# Altium project 驱动电路1_0.PrjPcb
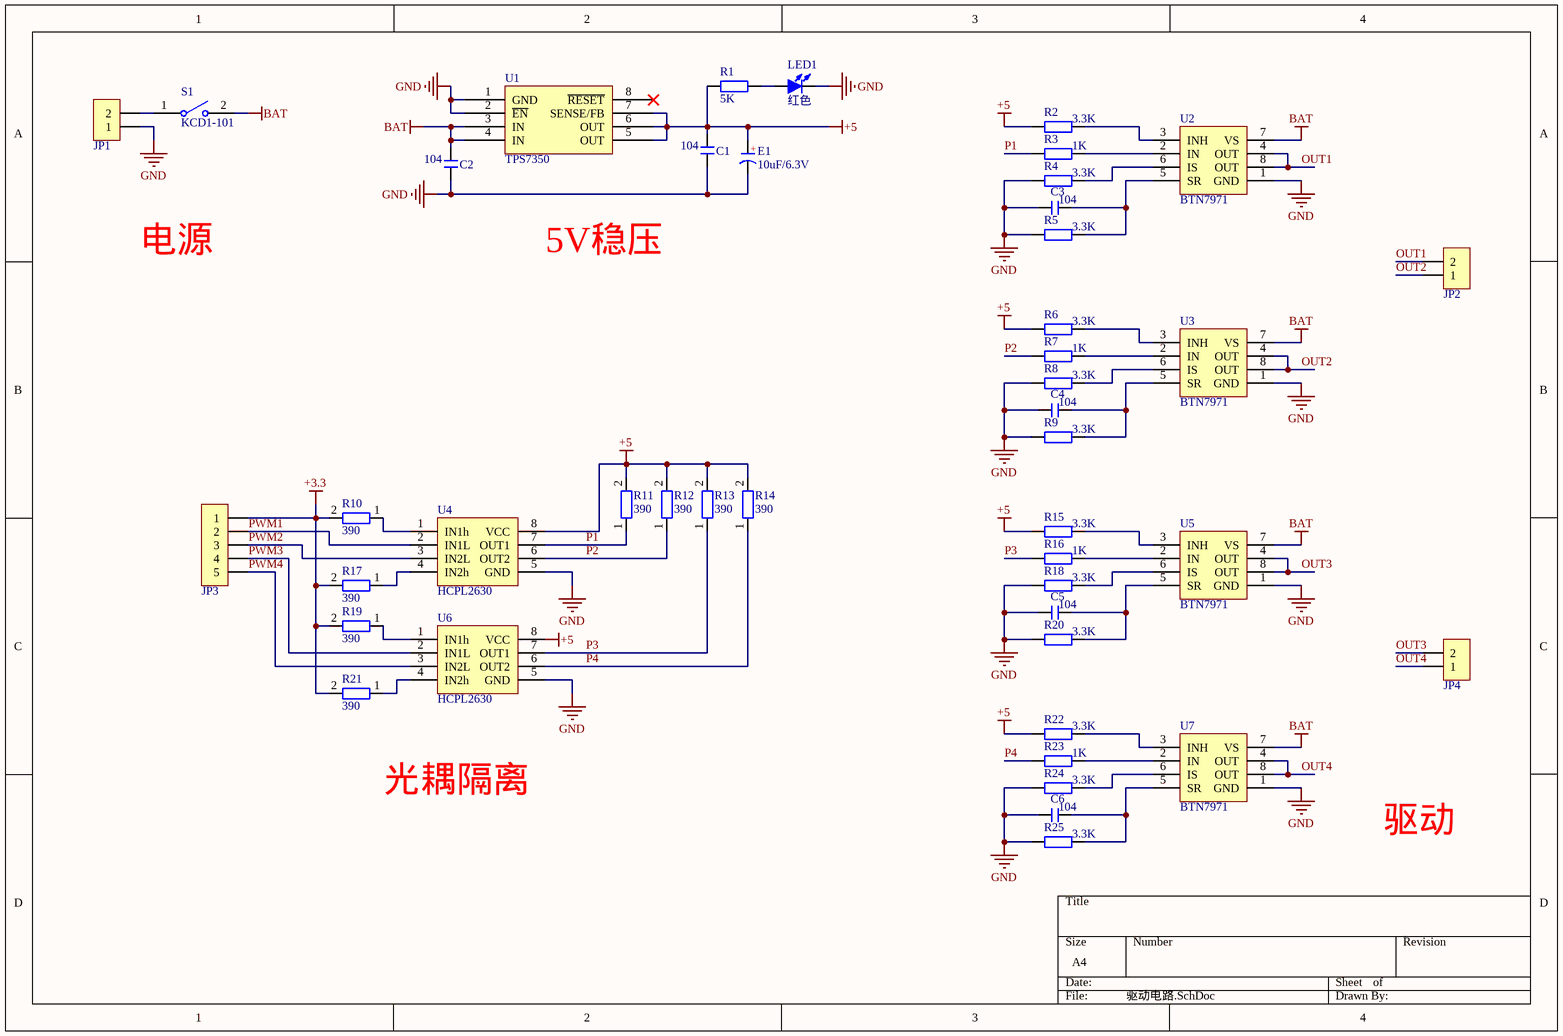
[diagram p0: 驱动电路.SchDoc]
1 sheet, 45 parts. Net scope: global (net labels, ports and power ports of the same name join across sheets).
Board file: 驱动电路1-0.PcbDoc

## Sheet 驱动电路.SchDoc
size A4

### Parts
C1  104  [C 0805_M]
C2  104  [C 0805_M]
C3  104  [C 0805_M]
C4  104  [C 0805_M]
C5  104  [C 0805_M]
C6  104  [C 0805_M]
E1  10uF/6.3V  [CD A(3216)]
JP1  HDR-1X2  [KF128-5.08-2P]  (value not drawn)
JP2  HDR-1X2  [KF128-5.08-2P]  (value not drawn)
JP3  HDR-1X5  [XH2.54-LI-5P]  (value not drawn)
JP4  HDR-1X2  [KF128-5.08-2P]  (value not drawn)
LED1  红色  [LED 0805R]
R1  5K  [R 0805-HP_M]
R2  3.3K  [R 0805-HP_M]
R3  1K  [R 0805-HP_M]
R4  3.3K  [R 0805-HP_M]
R5  3.3K  [R 0805-HP_M]
R6  3.3K  [R 0805-HP_M]
R7  1K  [R 0805-HP_M]
R8  3.3K  [R 0805-HP_M]
R9  3.3K  [R 0805-HP_M]
R10  390  [R 2512_M]
R11  390  [R 2512_M]
R12  390  [R 2512_M]
R13  390  [R 2512_M]
R14  390  [R 2512_M]
R15  3.3K  [R 0805-HP_M]
R16  1K  [R 0805-HP_M]
R17  390  [R 2512_M]
R18  3.3K  [R 0805-HP_M]
R19  390  [R 2512_M]
R20  3.3K  [R 0805-HP_M]
R21  390  [R 2512_M]
R22  3.3K  [R 0805-HP_M]
R23  1K  [R 0805-HP_M]
R24  3.3K  [R 0805-HP_M]
R25  3.3K  [R 0805-HP_M]
S1  KCD1-101  [KCD1-101]
U1  TPS7350  [SOP8]
U2  BTN7971  [DPAK127P1615X127-8N]
U3  BTN7971  [DPAK127P1615X127-8N]
U4  HCPL2630  [SOP8]
U5  BTN7971  [DPAK127P1615X127-8N]
U6  HCPL2630  [SOP8]
U7  BTN7971  [DPAK127P1615X127-8N]

### Nets
+3.3: JP3.1 R10.2 R17.2 R19.2 R21.2
+5: C1.2 E1.1(A) R1.1 R2.1 R6.1 R11.2 R12.2 R13.2 R14.2 R15.1 R22.1 U1.5(OUT) U1.6(OUT) U1.7(SENSE/FB) U4.8(VCC) U6.8(VCC)
BAT: C2.2 S1.2 U1.3(IN) U1.4(IN) U2.7(VS) U3.7(VS) U5.7(VS) U7.7(VS)
GND: C1.1 C2.1 C3.2 C4.2 C5.2 C6.2 E1.2(K) JP1.1 LED1.2(K) R4.1 R5.1 R8.1 R9.1 R18.1 R20.1 R24.1 R25.1 U1.1(GND) U1.2(~{EN}) U2.1(GND) U3.1(GND) U4.5(GND) U5.1(GND) U6.5(GND) U7.1(GND)
OUT1: JP2.2 U2.4(OUT) U2.8(OUT)
OUT2: JP2.1 U3.4(OUT) U3.8(OUT)
OUT3: JP4.2 U5.4(OUT) U5.8(OUT)
OUT4: JP4.1 U7.4(OUT) U7.8(OUT)
P1: R3.1 R11.1 U4.7(OUT1)
P2: R7.1 R12.1 U4.6(OUT2)
P3: R13.1 R16.1 U6.7(OUT1)
P4: R14.1 R23.1 U6.6(OUT2)
PWM1: JP3.2 U4.2(IN1L)
PWM2: JP3.3 U4.3(IN2L)
PWM3: JP3.4 U6.2(IN1L)
PWM4: JP3.5 U6.3(IN2L)
NetC3_1: C3.1 R5.2 U2.5(SR)
NetC4_1: C4.1 R9.2 U3.5(SR)
NetC5_1: C5.1 R20.2 U5.5(SR)
NetC6_1: C6.1 R25.2 U7.5(SR)
NetJP1_2: JP1.2 S1.1
NetLED1_1: LED1.1(A) R1.2
NetR2_2: R2.2 U2.3(INH)
NetR3_2: R3.2 U2.2(IN)
NetR4_2: R4.2 U2.6(IS)
NetR6_2: R6.2 U3.3(INH)
NetR7_2: R7.2 U3.2(IN)
NetR8_2: R8.2 U3.6(IS)
NetR10_1: R10.1 U4.1(IN1h)
NetR15_2: R15.2 U5.3(INH)
NetR16_2: R16.2 U5.2(IN)
NetR17_1: R17.1 U4.4(IN2h)
NetR18_2: R18.2 U5.6(IS)
NetR19_1: R19.1 U6.1(IN1h)
NetR21_1: R21.1 U6.4(IN2h)
NetR22_2: R22.2 U7.3(INH)
NetR23_2: R23.2 U7.2(IN)
NetR24_2: R24.2 U7.6(IS)

Not connected (* = marked no-connect by the designer): U1 8(~{RESET})*

### Notes on the sheet
- 电源
- 5V稳压
- 光耦隔离
- 驱动
- (in symbol C-CD) +

### Library data of the parts
C1-C6 = C: 无极性贴片电容; 版权归属: 源创客; BOM名称: 无极性贴片电容; 学习资源: www.ooocke.com
E1 = C-CD: 贴片钽电容; 版权归属: 源创客; BOM名称: 贴片钽电容; 学习资源: www.ooocke.com
JP1 JP2 JP4 = Header 2: 2P接插件; 版权归属: 源创客; BOM名称: 2P接插件; 学习资源: www.ooocke.com
JP3 = Header 5: 5P接插件; 版权归属: 源创客; BOM名称: 5P接插件; 学习资源: www.ooocke.com
LED1 = LED-SMD: 贴片LED; 版权归属: 源创客; BOM名称: 贴片LED; 学习资源: www.ooocke.com
R1-R9 R15 R16 R18 R20 R22-R25 = R-Precision: 精密贴片电阻; BOM名称: 精密电阻; 版权归属: 源创客; 学习资源: www.ooocke.com
R10-R14 R17 R19 R21 = R: 贴片电阻; 版权归属: 源创客; BOM名称: 贴片电阻; 学习资源: www.ooocke.com
S1 = KCD1-101: 1路单刀船型开关; 版权归属: 源创客; BOM名称: 1路单刀船型开关; 学习资源: www.ooocke.com
U1 = TPS7350: 稳压